# Altium schematic sheet TK2560_GPIO.SchDoc
size A4
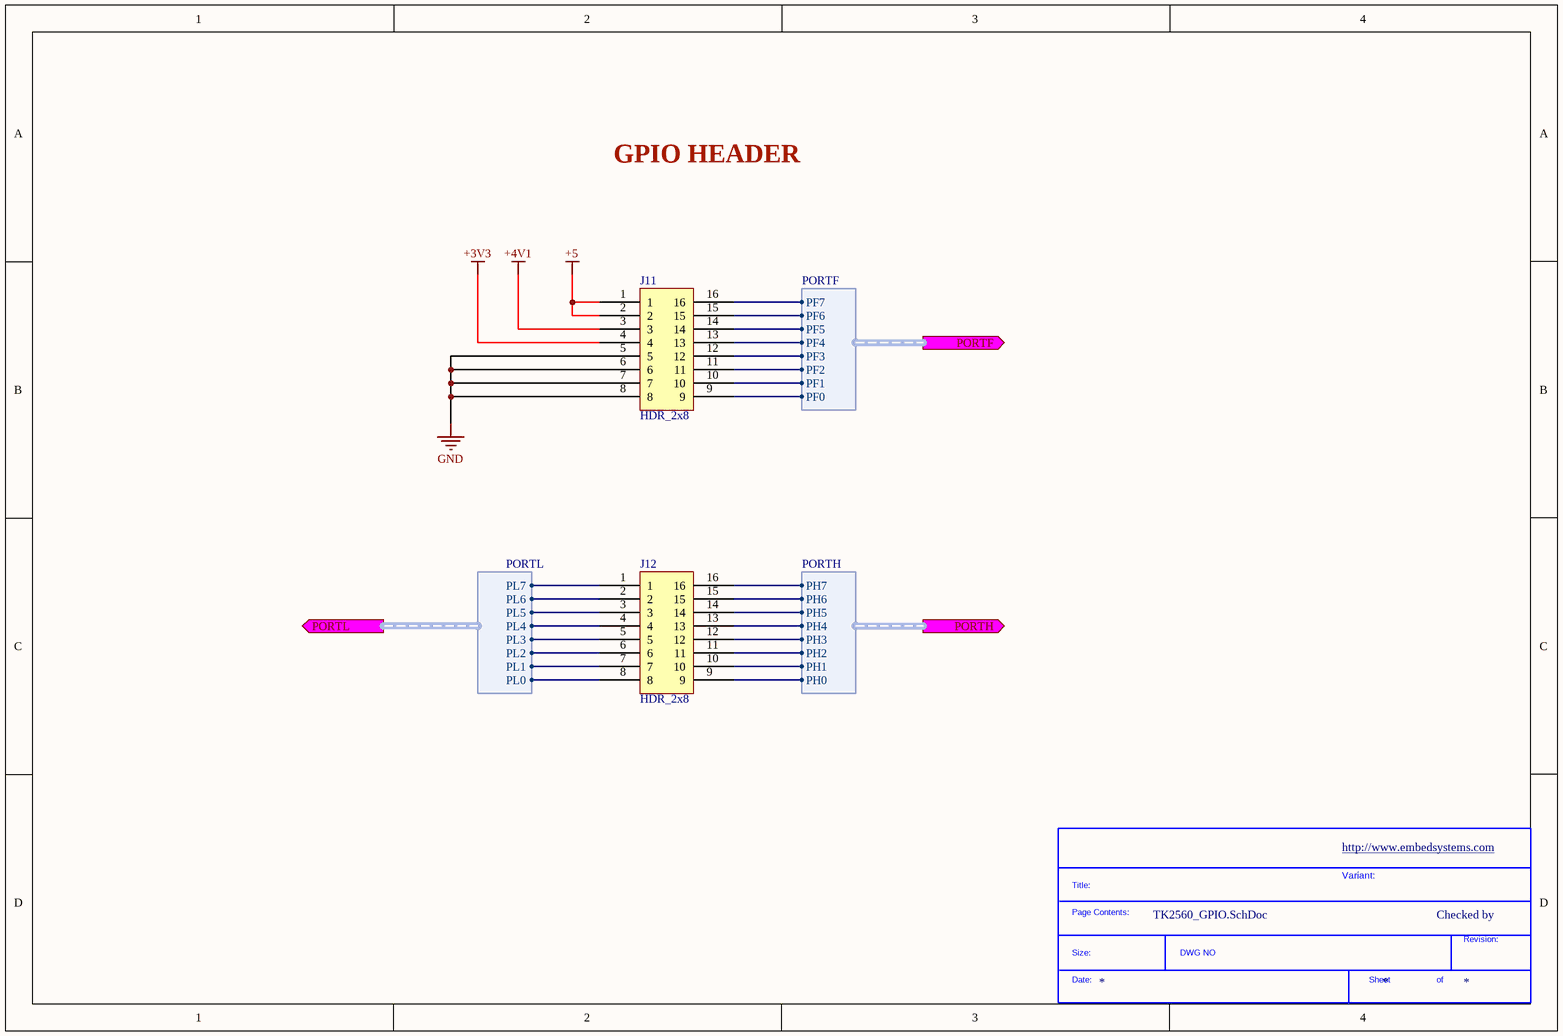
[diagram p0: TK2560_GPIO.SchDoc]

## Parts
*?  SDTitleBlock  (value not drawn)  (graphical)
J11  HDR_2x8  [HDR_2x8]
J12  HDR_2x8  [HDR_2x8]

## Ports
PORTF (out, harness PORTF), PORTH (out, harness PORTH), PORTL (out, harness PORTL)

## Harnesses
PORTF: PF0, PF1, PF2, PF3, PF4, PF5, PF6, PF7
PORTH: PH0, PH1, PH2, PH3, PH4, PH5, PH6, PH7
PORTL: PL0, PL1, PL2, PL3, PL4, PL5, PL6, PL7

## Nets
+3V3: J11.4
+4V1: J11.3
+5: J11.1 J11.2
GND: J11.5 J11.6 J11.7 J11.8
NetJ11_9: J11.9 ; port PORTF.PF0
NetJ11_10: J11.10 ; port PORTF.PF1
NetJ11_11: J11.11 ; port PORTF.PF2
NetJ11_12: J11.12 ; port PORTF.PF3
NetJ11_13: J11.13 ; port PORTF.PF4
NetJ11_14: J11.14 ; port PORTF.PF5
NetJ11_15: J11.15 ; port PORTF.PF6
NetJ11_16: J11.16 ; port PORTF.PF7
NetJ12_1: J12.1 ; port PORTL.PL7
NetJ12_2: J12.2 ; port PORTL.PL6
NetJ12_3: J12.3 ; port PORTL.PL5
NetJ12_4: J12.4 ; port PORTL.PL4
NetJ12_5: J12.5 ; port PORTL.PL3
NetJ12_6: J12.6 ; port PORTL.PL2
NetJ12_7: J12.7 ; port PORTL.PL1
NetJ12_8: J12.8 ; port PORTL.PL0
NetJ12_9: J12.9 ; port PORTH.PH0
NetJ12_10: J12.10 ; port PORTH.PH1
NetJ12_11: J12.11 ; port PORTH.PH2
NetJ12_12: J12.12 ; port PORTH.PH3
NetJ12_13: J12.13 ; port PORTH.PH4
NetJ12_14: J12.14 ; port PORTH.PH5
NetJ12_15: J12.15 ; port PORTH.PH6
NetJ12_16: J12.16 ; port PORTH.PH7

## Notes on the sheet
- GPIO HEADER
- http://www.embedsystems.com
- Variant:
- Checked by
- (in symbol SDTitleBlock) Title:; Page Contents:; Revision:; Size:; DWG NO; Date:; Sheet; of

## Library data of the parts
J11 J12 = HDR_2x8: CONN HDR FEMALE 16POS 0.1 GOLD PCB; Manufacturer: Sullins; Manufacturer Part Number: PPPC082LFBN-RC; Number of Positions: 16; Connector Type: Header; Pitch: 0.1inch; Supplier 1: Digi-Key; RoHS: Yes; Category: Connectors; Stock 1: 22838; Pricing 1: 1=1.03000, 10=0.90400, 100=0.78010, 500=0.63828, 1000=0.56736, 5000=0.51220 (USD); Mount: Through Hole; Color: Black; Contact Plating: Gold; Contact Material: Bronze; Housing Material: Plastic; Package Quantity: 1000; Number of Rows: 2; Packaging: Bulk; Termination: Solder; Contact Type: Female Socket; Length: 20.8mm; Width: 5mm; Height: 8.5mm; Row Spacing: 0.1inch; Lead Free: Lead Free; RoHS Compliant: Yes; ComponentLink1URL: https://media.digikey.com/pdf/Data%20Sheets/Sullins%20PDFs/Female_Headers.100_DS.pdf?src-supplier=Digi-Key; ComponentLink1Description: https://media.digikey.com/pdf/Data%20Sheets/Sullins%20PDFs/Female_Headers.100_DS.pdf?src-supplier=Digi-Key; ComponentLink2URL: http://www.sullinscorp.com/catalogs/101_Page80-81_HEADER_.100_2.54mm_FEMALE.pdf?src-supplier=Future+Electronics; ComponentLink2Description: http://www.sullinscorp.com/catalogs/101_Page80-81_HEADER_.100_2.54mm_FEMALE.pdf?src-supplier=Future+Electronics; Supplier Part Number 1: S7111-ND